# Altium schematic sheet Cerebro.SchDoc
size A4
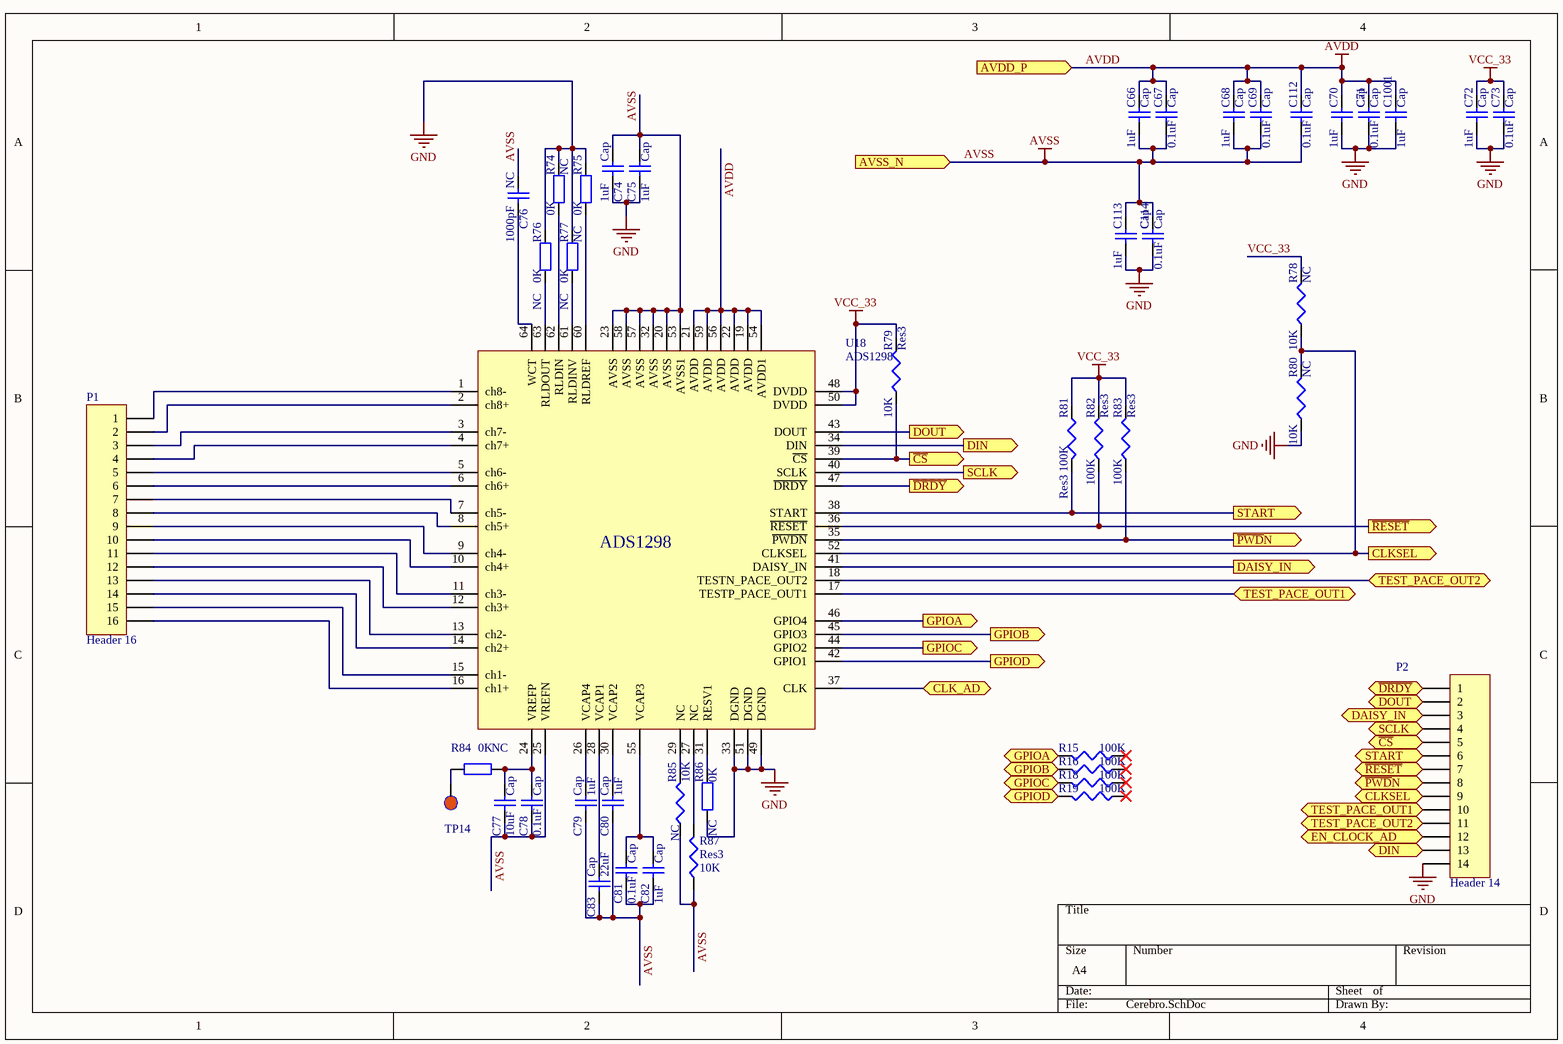
[diagram p0: Cerebro.SchDoc]

## Parts
C66  Cap  value 1uF  [cap_0402_R - modified]
C67  Cap  value 0.1uF  [cap_0402_R - modified]
C68  Cap  value 1uF  [cap_0402_R - modified]
C69  Cap  value 0.1uF  [cap_0402_R - modified]
C70  Cap  value 1uF  [cap_0402_R - modified]
C71  Cap  value 0.1uF  [cap_0402_R - modified]
C72  Cap  value 1uF  [cap_0402_R - modified]
C73  Cap  value 0.1uF  [cap_0402_R - modified]
C74  Cap  value 1uF  [cap_0402_R - modified]
C75  Cap  value 1uF  [cap_0402_R - modified]
C76  NC  value 1000pF  [cap_0402_R - modified]
C77  Cap  value 10uF  [cap_0402_R - modified]
C78  Cap  value 0.1uF  [cap_0402_R - modified]
C79  Cap  value 1uF  [cap_0402_R - modified]
C80  Cap  value 1uF  [cap_0402_R - modified]
C81  Cap  value 0.1uF  [cap_0402_R - modified]
C82  Cap  value 1uF  [cap_0402_R - modified]
C83  Cap  value 22uF  [cap_0402_R - modified]
C112  Cap  value 0.1uF  [cap_0402_R - modified]
C113  Cap  value 1uF  [cap_0402_R - modified]
C114  Cap  value 0.1uF  [cap_0402_R - modified]
C1001  Cap  value 1uF  [cap_0402_R - modified]
P1  Header 16  [61301621121]
P2  Header 14  [61301421121]
R15  value 100K  [res_0402_R - modified]  (hidden comment: Res3)
R16  value 100K  [res_0402_R - modified]  (hidden comment: Res3)
R18  value 100K  [res_0402_R - modified]  (hidden comment: Res3)
R19  value 100K  [res_0402_R - modified]  (hidden comment: Res3)
R74  NC  value 0K  [cap_0402_R - modified]
R75  NC  value 0K  [cap_0402_R - modified]
R76  NC  value 0K  [cap_0402_R - modified]
R77  NC  value 0K  [cap_0402_R - modified]
R78  NC  value 10K  [cap_0402_R - modified]
R79  Res3  value 10K  [res_0402_R - modified]
R80  NC  value 10K  [cap_0402_R - modified]
R81  Res3  value 100K  [res_0402_R - modified]
R82  Res3  value 100K  [res_0402_R - modified]
R83  Res3  value 100K  [res_0402_R - modified]
R84  NC  value 0K  [cap_0402_R - modified]
R85  NC  value 10K  [cap_0402_R - modified]
R86  NC  value 0K  [cap_0402_R - modified]
R87  Res3  value 10K  [res_0402_R - modified]
TP14  1-PIN  [Testpt_055]  (value not drawn)
U18  ADS1298  [S-PQFP - G64 - ADS1298]

## Ports
AVDD_P (in), AVSS_N (in), CLK_AD (bidir), CLKSEL (out), DAISY_IN (out), DIN (out), DOUT (out), EN_CLOCK_AD (bidir), GPIOA (out), GPIOB (out), GPIOC (out), GPIOD (out), SCLK (out), START (out), TEST_PACE_OUT1 (bidir), TEST_PACE_OUT2 (bidir), ~{CS} (out), ~{DRDY} (out), ~{PWD}N (out), ~{RESET} (out)

## Nets
AVDD: C66.2 C67.2 C68.2 C69.2 C70.2 C71.2 C112.2 C1001.2 U18.19(AVDD) U18.21(AVDD) U18.22(AVDD) U18.54(AVDD1) U18.56(AVDD) U18.59(AVDD) ; port AVDD_P
AVSS: C66.1 C67.1 C68.1 C69.1 C74.1 C75.1 C76.1 C77.1 C78.1 C79.1 C80.1 C81.1 C82.1 C83.1 C112.1 C113.2 C114.2 R85.1 R87.1 U18.20(AVSS) U18.23(AVSS) U18.25(VREFN) U18.32(AVSS) U18.53(AVSS1) U18.57(AVSS) U18.58(AVSS) ; port AVSS_N
GND: C70.1 C71.1 C72.1 C73.1 C74.2 C75.2 C113.1 C114.1 C1001.1 P2.14 R74.1 R75.1 R76.1 R77.1 R80.1 R86.2 U18.33(DGND) U18.49(DGND) U18.51(DGND)
VCC_33: C72.2 C73.2 R78.2 R79.2 R81.1 R82.2 R83.2 U18.48(DVDD) U18.50(DVDD)
~{CS}: P2.5 R79.1 U18.39(~{CS}) ; port ~{CS}
CLK_AD: U18.37(CLK) ; port CLK_AD
CLKSEL: P2.9 R78.1 R80.2 U18.52(CLKSEL) ; port CLKSEL
~{DRDY}: P2.1 U18.47(~{DRDY}) ; port ~{DRDY}
DAISY_IN: P2.3 U18.41(DAISY_IN) ; port DAISY_IN
DIN: P2.13 U18.34(DIN) ; port DIN
DOUT: P2.2 U18.43(DOUT) ; port DOUT
EN_CLOCK_AD: P2.12 ; port EN_CLOCK_AD
GPIOA: R15.2 U18.46(GPIO4) ; port GPIOA
GPIOB: R16.2 U18.45(GPIO3) ; port GPIOB
GPIOC: R18.2 U18.44(GPIO2) ; port GPIOC
GPIOD: R19.2 U18.42(GPIO1) ; port GPIOD
~{PWD}N: P2.8 R83.1 U18.35(~{PWDN}) ; port ~{PWD}N
~{RESET}: P2.7 R82.1 U18.36(~{RESET}) ; port ~{RESET}
SCLK: P2.4 U18.40(SCLK) ; port SCLK
START: P2.6 R81.2 U18.38(START) ; port START
TEST_PACE_OUT1: P2.10 U18.17(TESTP_PACE_OUT1) ; port TEST_PACE_OUT1
TEST_PACE_OUT2: P2.11 U18.18(TESTN_PACE_OUT2) ; port TEST_PACE_OUT2
NetC76_2: C76.2 U18.64(WCT)
NetC77_2: C77.2 C78.2 R84.2 U18.24(VREFP)
NetC79_2: C79.2 U18.26(VCAP4)
NetC80_2: C80.2 U18.30(VCAP2)
NetC81_2: C81.2 C82.2 U18.55(VCAP3)
NetC83_2: C83.2 U18.28(VCAP1)
NetP1_1: P1.1 U18.1(ch8-)
NetP1_2: P1.2 U18.2(ch8+)
NetP1_3: P1.3 U18.3(ch7-)
NetP1_4: P1.4 U18.4(ch7+)
NetP1_5: P1.5 U18.5(ch6-)
NetP1_6: P1.6 U18.6(ch6+)
NetP1_7: P1.7 U18.7(ch5-)
NetP1_8: P1.8 U18.8(ch5+)
NetP1_9: P1.9 U18.9(ch4-)
NetP1_10: P1.10 U18.10(ch4+)
NetP1_11: P1.11 U18.11(ch3-)
NetP1_12: P1.12 U18.12(ch3+)
NetP1_13: P1.13 U18.13(ch2-)
NetP1_14: P1.14 U18.14(ch2+)
NetP1_15: P1.15 U18.15(ch1-)
NetP1_16: P1.16 U18.16(ch1+)
NetR74_2: R74.2 U18.62(RLDIN)
NetR75_2: R75.2 U18.60(RLDREF)
NetR76_2: R76.2 U18.63(RLDOUT)
NetR77_2: R77.2 U18.61(RLDINV)
NetR84_1: R84.1 TP14.1
NetR85_2: R85.2 U18.29(NC)
NetR86_1: R86.1 U18.31(RESV1)
NetR87_2: R87.2 U18.27(NC)

Not connected (* = marked no-connect by the designer): R15 1*; R16 1*; R18 1*; R19 1*

## Library data of the parts
C66-C83 C112-C114 C1001 = Cap: Capacitor; Published: 8-Jun-2000; LatestRevisionDate: 17-Jul-2002; LatestRevisionNote: Re-released for DXP Platform.; PackageReference: RAD-0.3; Publisher: Altium Limited; PackageDescription: Radial Cap, Thru-Hole; 2 Leads; 0.3 in Pin Spacing
P1 = Header 16: Header, 16-Pin; LatestRevisionDate: 17-Jul-2002; LatestRevisionNote: Re-released for DXP Platform.; Publisher: Altium Limited
P2 = Header 14: Header, 14-Pin; LatestRevisionDate: 17-Jul-2002; LatestRevisionNote: Re-released for DXP Platform.; Publisher: Altium Limited
R15 R16 R18 R19 R78-R83 R85 R87 = Res3: Resistor; Published: 8-Jun-2000; LatestRevisionDate: 29-May-2009; LatestRevisionNote: IPC-7351 Footprint Added.; PackageReference: J1-0603; Publisher: Altium Limited; PackageDescription: Chip Resistor
R74-R77 R84 R86 = Res2: Resistor; Published: 8-Jun-2000; LatestRevisionDate: 17-Jul-2002; LatestRevisionNote: Re-released for DXP Platform.; PackageReference: AXIAL-0.4; Publisher: Altium Limited; PackageDescription: Axial Device, Thru-Hole; 2 Leads; 0.4 in Pin Spacing